# EAGLE schematic Sensor Board A (EAGLE 8.4.1)
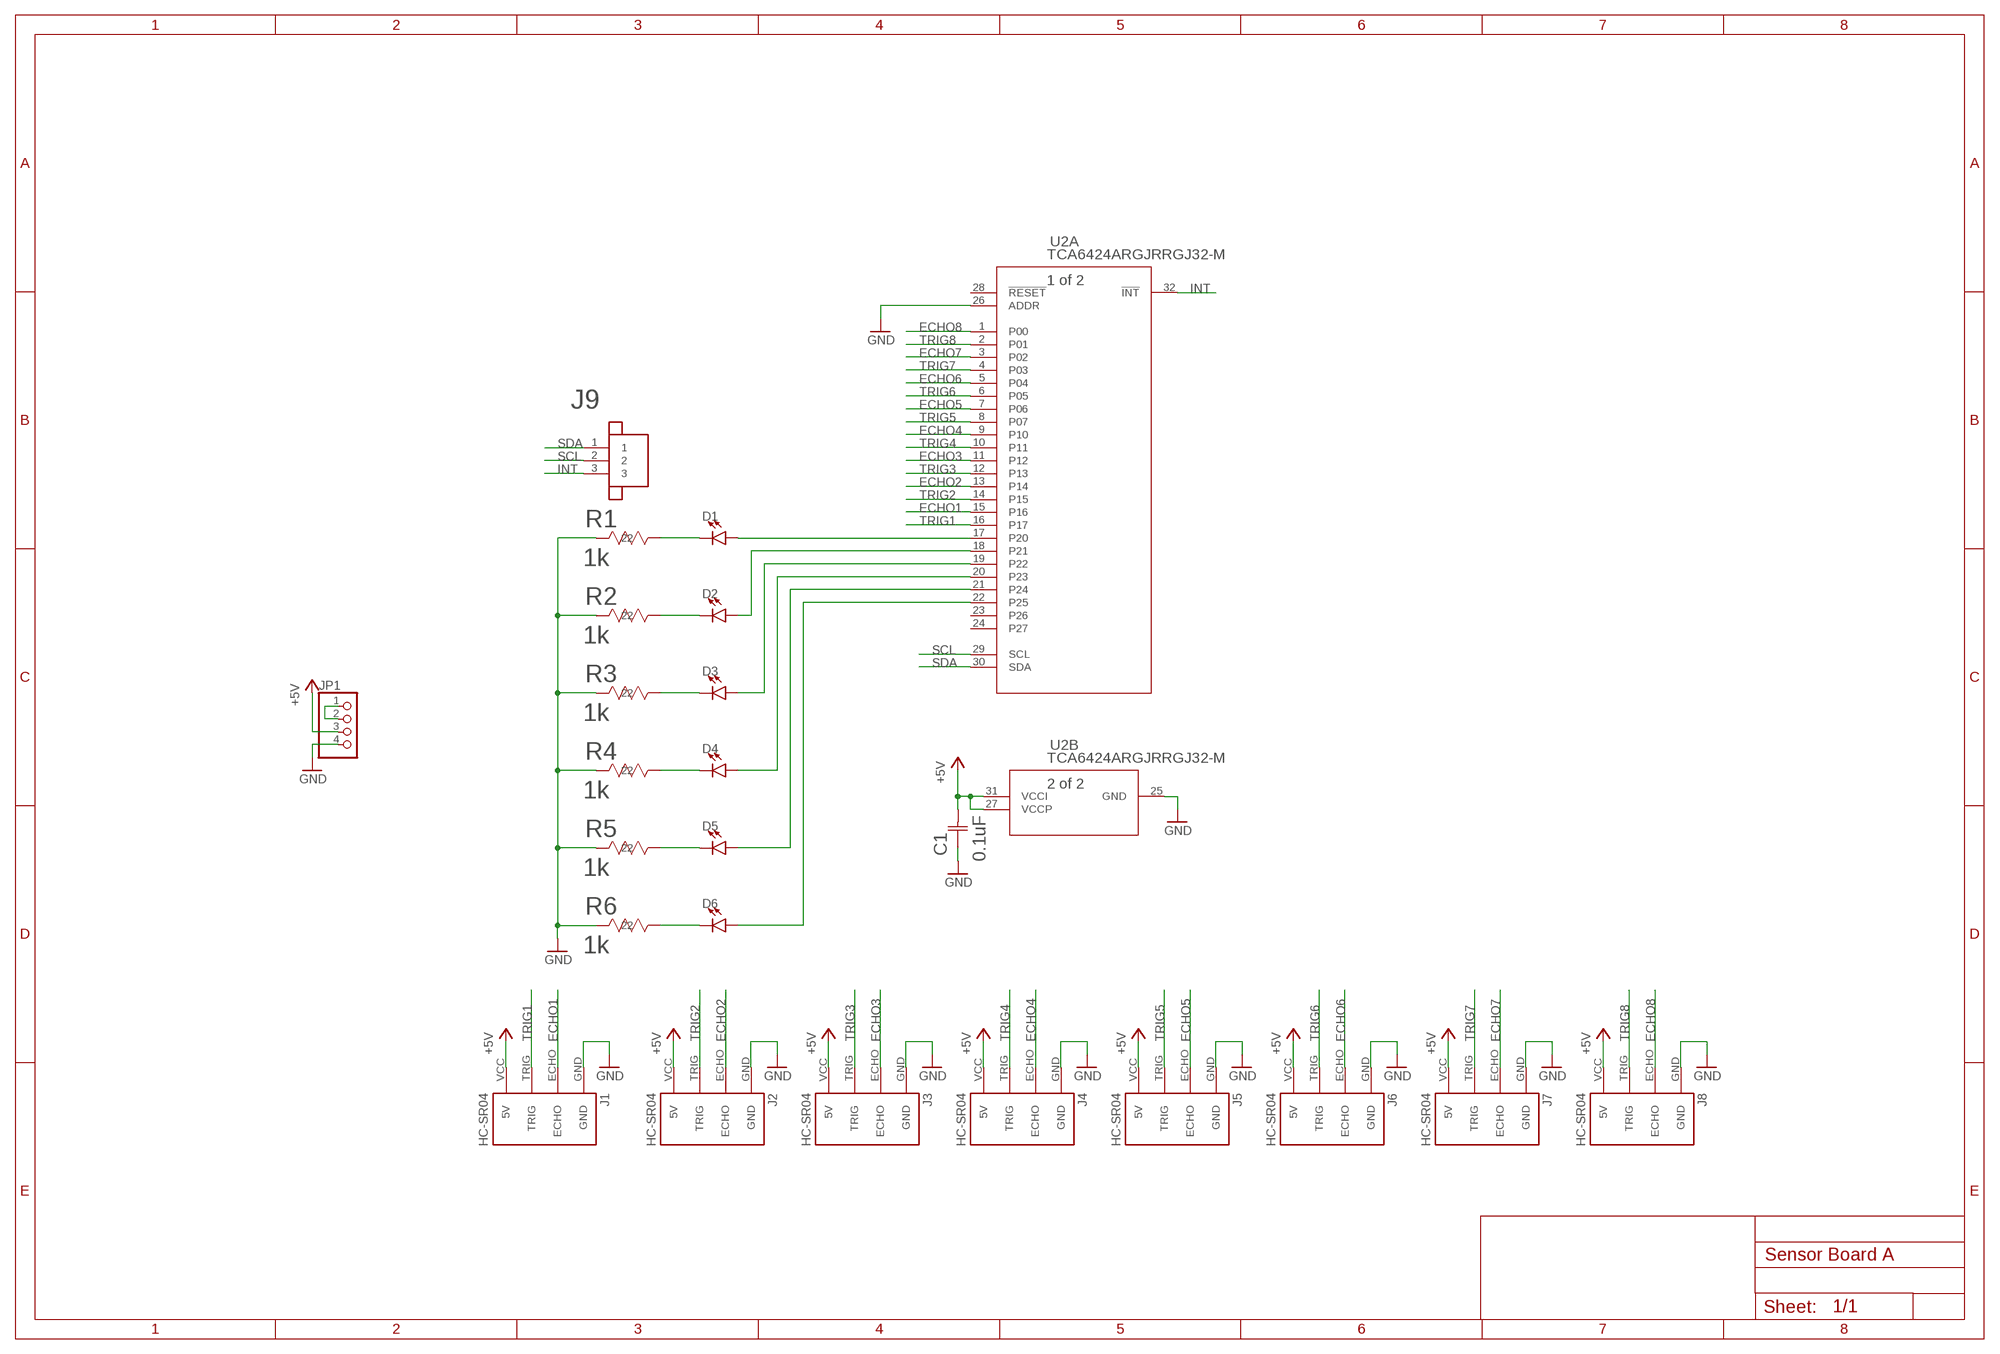
[diagram p0: schematic, sheet 1]

## Parts
C1  0.1uF  08055C104KAT2A  [0805]
D1  LED0603  [LED-0603]
D2  LED0603  [LED-0603]
D3  LED0603  [LED-0603]
D4  LED0603  [LED-0603]
D5  LED0603  [LED-0603]
D6  LED0603  [LED-0603]
J1  HC-SR04  [HC-SR04_FOOTPRINT]
J2  HC-SR04  [HC-SR04_FOOTPRINT]
J3  HC-SR04  [HC-SR04_FOOTPRINT]
J4  HC-SR04  [HC-SR04_FOOTPRINT]
J5  HC-SR04  [HC-SR04_FOOTPRINT]
J6  HC-SR04  [HC-SR04_FOOTPRINT]
J7  HC-SR04  [HC-SR04_FOOTPRINT]
J8  HC-SR04  [HC-SR04_FOOTPRINT]
J9  JST_SH_3POS  [JST_SH_3POS]
JP1  PINHD-1X4  [1X04]
R1  1k  RC0603JR-071KLRC0603N-M  [RC0603N-M]
R2  1k  RC0603JR-071KLRC0603N-M  [RC0603N-M]
R3  1k  RC0603JR-071KLRC0603N-M  [RC0603N-M]
R4  1k  RC0603JR-071KLRC0603N-M  [RC0603N-M]
R5  1k  RC0603JR-071KLRC0603N-M  [RC0603N-M]
R6  1k  RC0603JR-071KLRC0603N-M  [RC0603N-M]
U2  TCA6424ARGJRRGJ32-M  [RGJ32-M]

## Nets
+5V: C1.2 J1.VCC(5V) J2.VCC(5V) J3.VCC(5V) J4.VCC(5V) J5.VCC(5V) J6.VCC(5V) J7.VCC(5V) J8.VCC(5V) JP1.3 U2.27(B:VCCP) U2.31(B:VCCI)
ECHO1: J1.ECHO U2.15(A:P16)
ECHO2: J2.ECHO U2.13(A:P14)
ECHO3: J3.ECHO U2.11(A:P12)
ECHO4: J4.ECHO U2.9(A:P10)
ECHO5: J5.ECHO U2.7(A:P06)
ECHO6: J6.ECHO U2.5(A:P04)
ECHO7: J7.ECHO U2.3(A:P02)
ECHO8: J8.ECHO U2.1(A:P00)
GND: C1.1 J1.GND J2.GND J3.GND J4.GND J5.GND J6.GND J7.GND J8.GND JP1.4 R1.2 R2.2 R3.2 R4.2 R5.2 R6.2 U2.25(B:GND) U2.26(A:ADDR)
INT: J9.3 U2.32(A:!INT)
N$1: JP1.1 JP1.2
N$2: D1.A U2.17(A:P20)
N$3: D2.A U2.18(A:P21)
N$4: D3.A U2.19(A:P22)
N$5: D4.A U2.20(A:P23)
N$6: D5.A U2.21(A:P24)
N$7: D6.A U2.22(A:P25)
N$8: D6.C R6.1
N$9: D5.C R5.1
N$10: D4.C R4.1
N$11: D3.C R3.1
N$12: D2.C R2.1
N$13: D1.C R1.1
SCL: J9.2 U2.29(A:SCL)
SDA: J9.1 U2.30(A:SDA)
TRIG1: J1.TRIG U2.16(A:P17)
TRIG2: J2.TRIG U2.14(A:P15)
TRIG3: J3.TRIG U2.12(A:P13)
TRIG4: J4.TRIG U2.10(A:P11)
TRIG5: J5.TRIG U2.8(A:P07)
TRIG6: J6.TRIG U2.6(A:P05)
TRIG7: J7.TRIG U2.4(A:P03)
TRIG8: J8.TRIG U2.2(A:P01)
Unconnected: U2.23(A:P26) U2.24(A:P27) U2.28(A:!RESET)

## Library data of the parts
C1 = 0.1uF X7R Ceramic Capacitor:08055C104KAT2A; COPYRIGHT: Copyright C 2015 Accelerated Designs. All rights reserved; MANUFACTURER_PART_NUMBER: 08055C104KAT2A; VENDOR: Vendor
D1-D6 = SparkFun-LED:LED: LED (Generic) Standard schematic elements and footprints for 5mm, 3mm, 1206, and 0603 sized LEDs. Generic LEDs with no color specified.
J1-J8 = Ultrasonic Sensor HC-SR04:HC-SR04: Ultrasonic Sensor HC-SR04
J9 = thanics_robotics:JST_SH_3POS
JP1 = pinhead:PINHD-1X4: PIN HEADER
R1-R6 = 1k-resistor:RC0603JR-071KL; CASE: 0603 1608 metric; COMPOSITION: Thick Film; COPYRIGHT: Copyright C 2015 Accelerated Designs. All rights reserved; DATASHEET: httpwww.yageo.comdocumentsrecentPYuRC0603_51_RoHS_L_4.pdf; DESCRIPTION: RES 1.0K OHM 110W 5% 0603 SMD; DIGIKEYPARTNUMBER: 3111.0KGRTRND; HEIGHT: 0.022" 0.55mm; LEADSTYLE: Surface Mount SMD SMT; MANUFACTURER_PART_NUMBER: RC0603JR071KL; NEWARKPARTNUMBER: 14M7231; NUMBEROFTERMINATIONS: 2; PACKAGECASE: 0603 1608 Metric; PACKAGING: Tape &amp Reel TR; POWERWATTS: 0.1W 110W; QUANTITY_AVAILABLE: 0; RESISTANCEINOHMS: 1.00K; RESISTANCEOHMS: 1K; SIZEDIMENSION: 0.063" L x 0.031" W 1.60mm x 0.80mm; TEMPERATURECOEFFICIENT: 100ppm°C; TOLERANCE: 5%; VENDOR: Yageo; VOLTAGEWORKING: 50V
U2 = TCA6424-expander:TCA6424ARGJR; MANUFACTURER_PART_NUMBER: TCA6424ARGJR; VENDOR: Texas Instruments